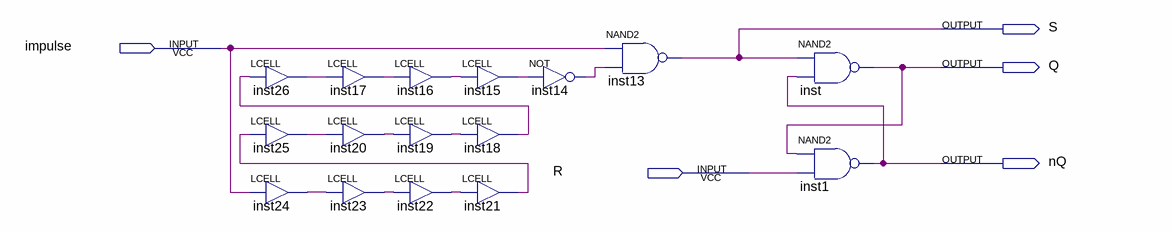
[diagram p0: schematic sheet]
// Quartus schematic t1.bdf as structural Verilog: 16 symbols, 5 pins
module t1 (
  input  impulse,
  input  R,
  output S,
  output Q,
  output nQ
);

  wire inst14_out, inst15_out, inst16_out, inst17_out, inst18_out, inst19_out, inst20_out, inst21_out,
       inst22_out, inst23_out, inst24_out, inst25_out, inst26_out;

  LCELL inst26 (.IN(inst18_out), .OUT(inst26_out));
  LCELL inst25 (.IN(inst21_out), .OUT(inst25_out));
  LCELL inst24 (.IN(impulse), .OUT(inst24_out));
  LCELL inst17 (.IN(inst26_out), .OUT(inst17_out));
  LCELL inst20 (.IN(inst25_out), .OUT(inst20_out));
  LCELL inst23 (.IN(inst24_out), .OUT(inst23_out));
  LCELL inst16 (.IN(inst17_out), .OUT(inst16_out));
  LCELL inst19 (.IN(inst20_out), .OUT(inst19_out));
  LCELL inst22 (.IN(inst23_out), .OUT(inst22_out));
  LCELL inst15 (.IN(inst16_out), .OUT(inst15_out));
  LCELL inst18 (.IN(inst19_out), .OUT(inst18_out));
  LCELL inst21 (.IN(inst22_out), .OUT(inst21_out));
  not inst14 (inst14_out, inst15_out);
  nand inst13 (S, impulse, inst14_out);
  nand inst (Q, S, nQ);
  nand inst1 (nQ, Q, R);
endmodule
